# Altium schematic sheet soldier_Integrators.SchDoc
size Tabloid; SheetNumber: 5; SheetTotal: 6
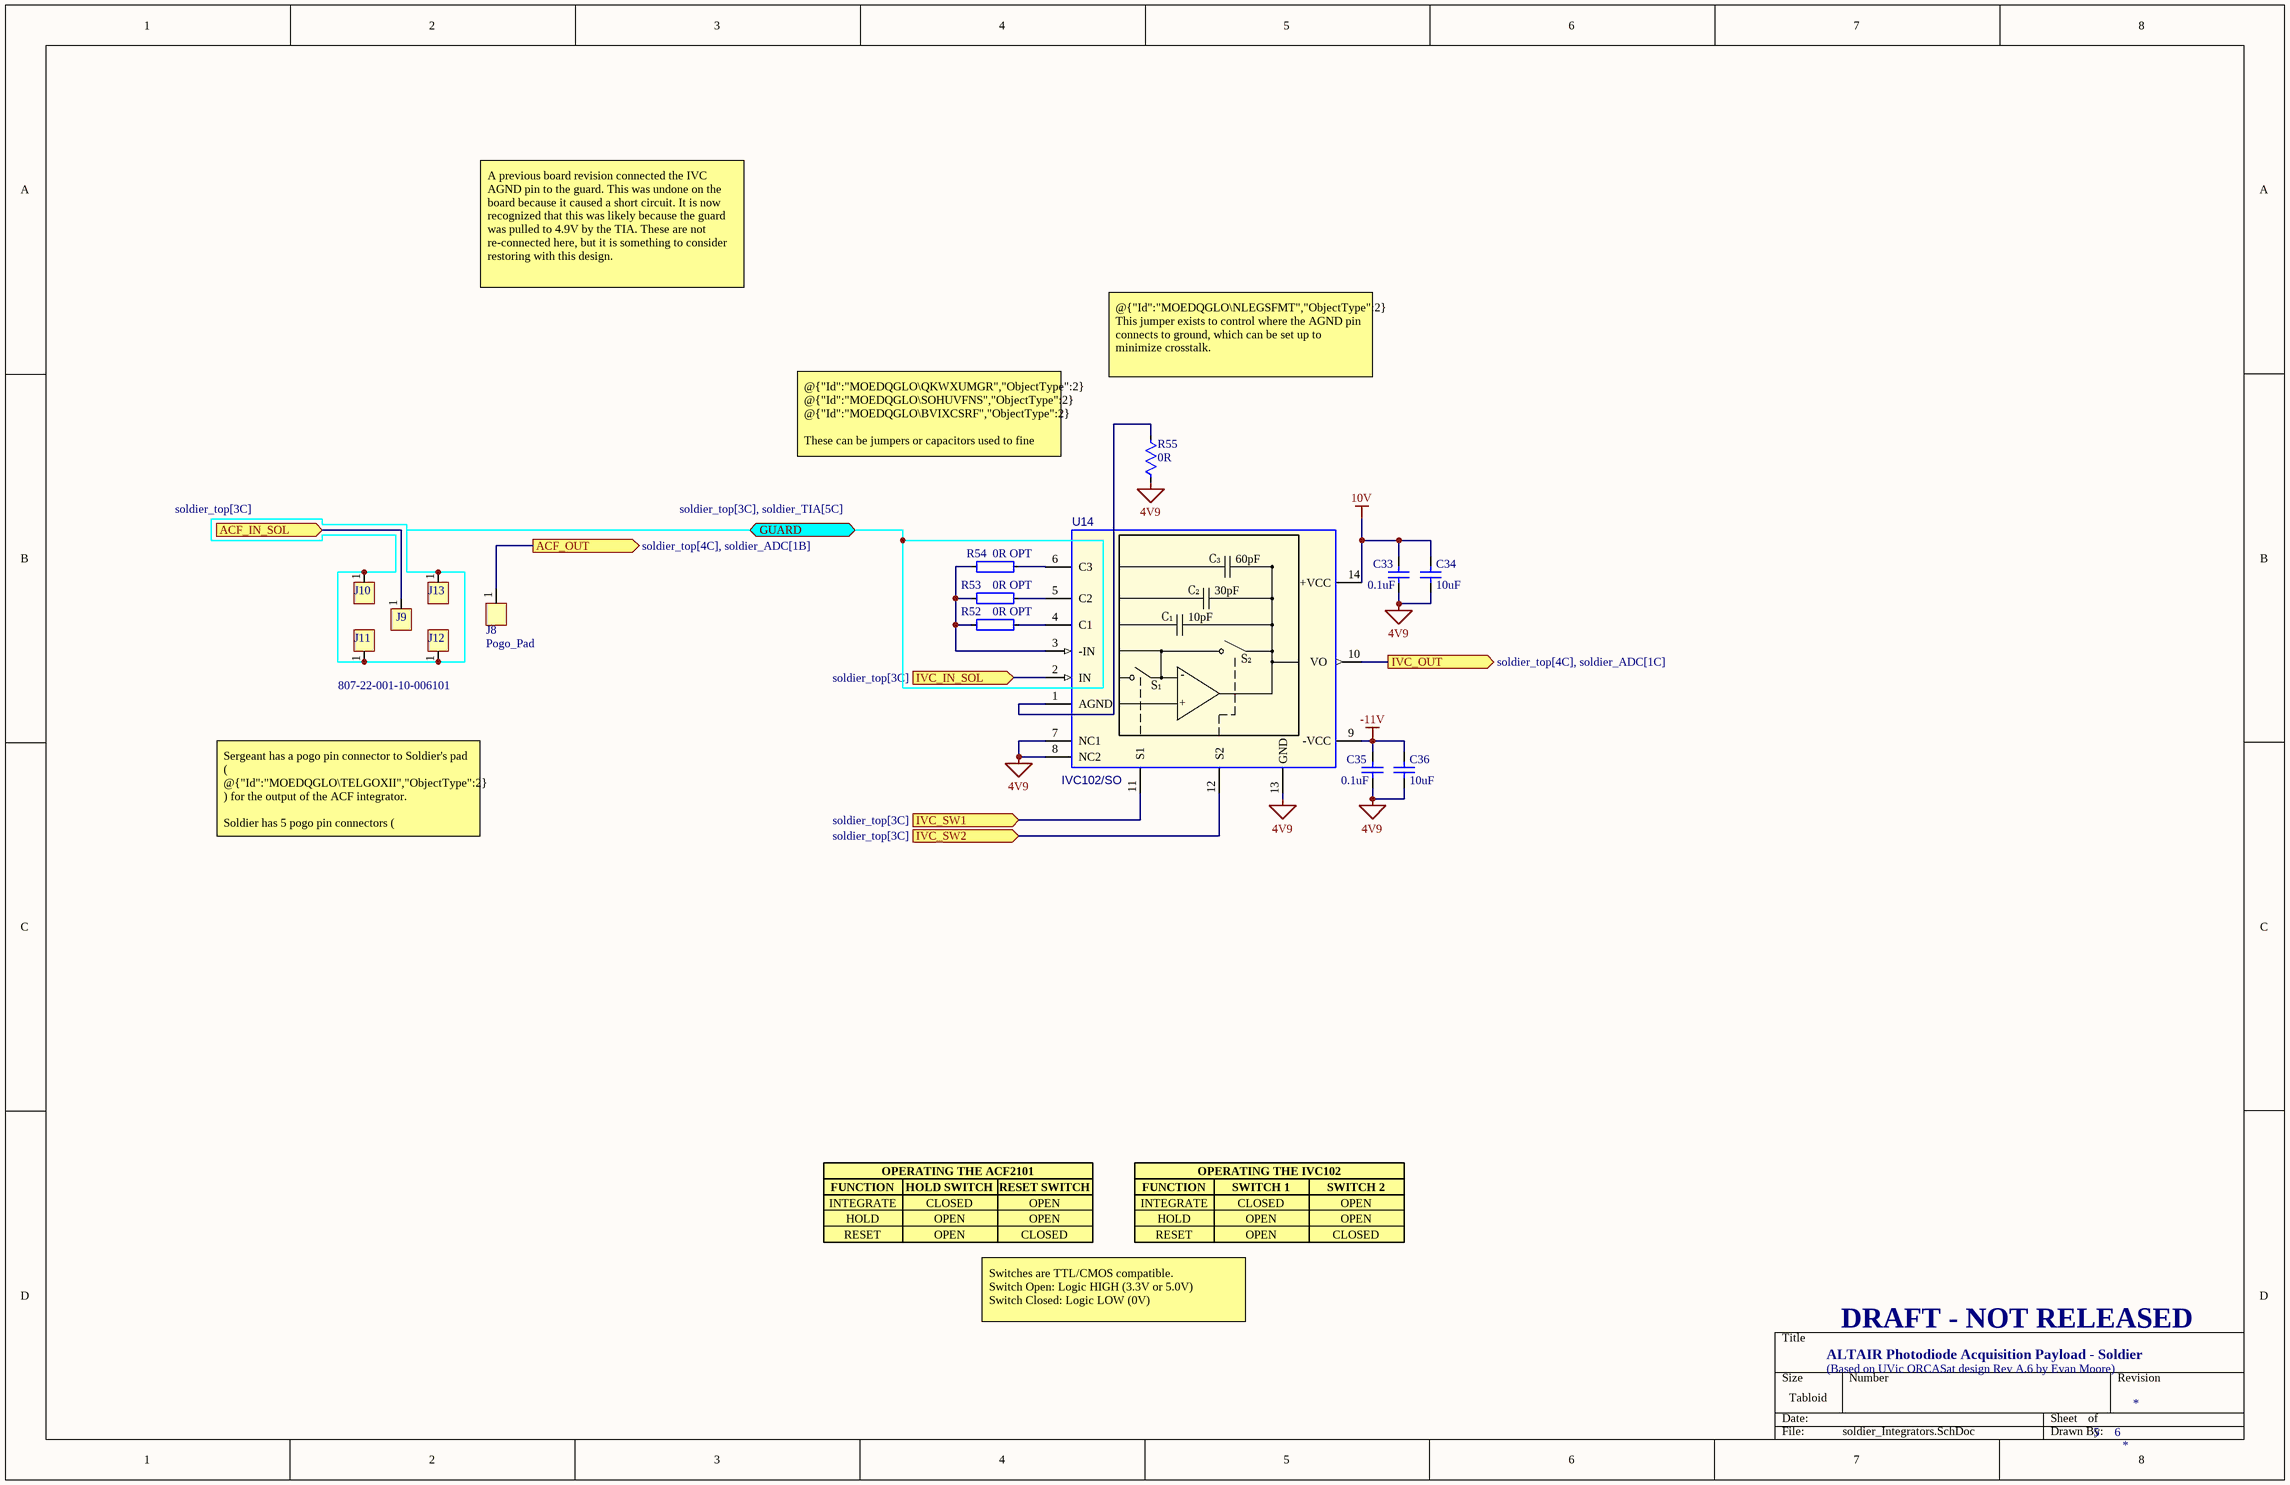
[diagram p0: soldier_Integrators.SchDoc]

## Parts
C33  0.1uF  [CAP 0603 NON-IPC KEMET X7R]
C34  10uF  [CAP 0805 IPC MID DENSITY]
C35  0.1uF  [CAP 0603 NON-IPC KEMET X7R]
C36  10uF  [CAP 0805 IPC MID DENSITY]
J8  Pogo_Pad  [POGO PAD SOLDIER]  (no BOM)
J9  807-22-001-10-006101  [POGO PIN 807-22-001-10-006101]
J10  807-22-001-10-006101  [POGO PIN 807-22-001-10-006101]  (value not drawn)
J11  807-22-001-10-006101  [POGO PIN 807-22-001-10-006101]  (value not drawn)
J12  807-22-001-10-006101  [POGO PIN 807-22-001-10-006101]  (value not drawn)
J13  807-22-001-10-006101  [POGO PIN 807-22-001-10-006101]  (value not drawn)
R52  0R OPT  [RES 0402 IPC LOW DENSITY]
R53  0R OPT  [RES 0402 IPC LOW DENSITY]
R54  0R OPT  [RES 0402 IPC LOW DENSITY]
R55  0R  [RES 0402 IPC MID DENSITY]
U14  IVC102/SO  [14-SOIC 4MM WIDE LOW DENSITY]

## Ports
ACF_IN_SOL (in, see soldier_top[3C]), ACF_OUT (out, see soldier_top[4C], soldier_ADC[1B]), GUARD (bidir, see soldier_top[3C], soldier_TIA[5C]), IVC_IN_SOL (in, see soldier_top[3C]), IVC_OUT (out, see soldier_top[4C], soldier_ADC[1C]), IVC_SW1 (in, see soldier_top[3C]), IVC_SW2 (in, see soldier_top[3C])

## Nets
4V9: C33.1 C34.1 C35.1 C36.1 R55.2 U14.7(NC1) U14.8(NC2) U14.13(GND)
10V: C33.2 C34.2 U14.14(+VCC)
-11V: C35.2 C36.2 U14.9(-VCC)
ACF_IN_SOL: J9.1 ; port ACF_IN_SOL
ACF_OUT: J8.1 ; port ACF_OUT
GUARD: J10.1 J11.1 J12.1 J13.1 ; port GUARD
IVC_IN_SOL: U14.2(IN) ; port IVC_IN_SOL
IVC_OUT: U14.10(VO) ; port IVC_OUT
IVC_SW1: U14.11(S1) ; port IVC_SW1
IVC_SW2: U14.12(S2) ; port IVC_SW2
NetR52_1: R52.1 R53.1 R54.1 U14.3(-IN)
NetR52_2: R52.2 U14.4(C1)
NetR53_2: R53.2 U14.5(C2)
NetR54_2: R54.2 U14.6(C3)
NetR55_1: R55.1 U14.1(AGND)

## Notes on the sheet
- A previous board revision connected the IVC AGND pin to the guard. This was undone on the board because it caused a short circuit. It is now recognized that this was likely because the guard was pulled to 4.9V by the TIA. These are not re-connected here, but it is something to consider restoring with this design.
- @{"Id":"MOEDQGLO\NLEGSFMT","ObjectType":2}
  This jumper exists to control where the AGND pin connects to ground, which can be set up to minimize crosstalk.
- @{"Id":"MOEDQGLO\QKWXUMGR","ObjectType":2} @{"Id":"MOEDQGLO\SOHUVFNS","ObjectType":2} @{"Id":"MOEDQGLO\BVIXCSRF","ObjectType":2}
  These can be jumpers or capacitors used to fine tune the IVC's response. At least one must be populated to close the op-amp feedback loop.
- Sergeant has a pogo pin connector to Soldier's pad ( @{"Id":"MOEDQGLO\TELGOXII","ObjectType":2} ) for the output of the ACF integrator.
  Soldier has 5 pogo pin connectors ( @{"Id":"MOEDQGLO\XDCRJTAV","ObjectType":2} @{"Id":"MOEDQGLO\LCOTXSJK","ObjectType":2} @{"Id":"MOEDQGLO\DWRKQWNA","ObjectType":2} ) arranged as a (signal pin surrounded by 4 guard pins) to Sergeant's pads for the input and guard on its side of the ACF integrator.
- FUNCTION
- INTEGRATE
- HOLD
- RESET
- OPERATING THE ACF2101
- HOLD SWITCH
- CLOSED
- OPEN
- RESET SWITCH
- OPERATING THE IVC102
- SWITCH 1
- SWITCH 2
- Switches are TTL/CMOS compatible.
  Switch Open: Logic HIGH (3.3V or 5.0V)
  Switch Closed: Logic LOW (0V)
- ALTAIR Photodiode Acquisition Payload - Soldier
- (Based on UVic ORCASat design Rev A.6 by Evan Moore)
- DRAFT - NOT RELEASED
- (in symbol IVC102/SO_5) C₃; 60pF; C₂; 30pF; C₁; 10pF; S₂; -; S₁; +

## Library data of the parts
C33 C35 = CAP: Kemet C0603C104K5RACAUTO - Cap Ceramic 0.1uF 50V X7R 10% 0603 125C Paper T/R; MF: Kemet; MP: C0603C104K5RACAUTO
C34 C36 = CAP: Murata GRM21BR61E106KA73L - Cap Ceramic 10uF 10% 25V X5R 0805; MF: Murata; MP: GRM21BR61E106KA73L
J8 = Pogo_Pad_NoGuard: Pad for Pogo Pin without Guard
J9-J13 = 807-22-001-10-006101: Mill-Max Individual Insulated Pin 5.99mm Initial Height; MF: Mill-Max; MP: 807-22-001-10-006101
R52-R54 = IMPEDANCE: Yageo RC0402JR-070RL - Res 0 Ohms 1/16W SMD 0402; MF: YAGEO; MP: RC0402JR-070RL
R55 = RES: Yageo RC0402JR-070RL - Res 0 Ohms 1/16W SMD 0402; MF: YAGEO; MP: RC0402JR-070RL
U14 = IVC102/SO_5: Precision Switched Integrator Transimpedance Amplifier; MF: Texas Instruments; MP: IVC102/SO